# EAGLE design swdtousb (EAGLE 7.1.0)
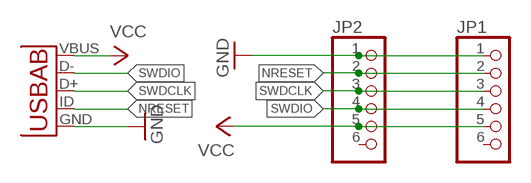
[diagram p0: schematic, sheet 1]

## Parts
JP1  PINHD-1X6  [1X06]
JP2  PINHD-1X6  [1X06]
U1  USB-AB  [USB-AB-MICRO]

## Nets
GND: JP1.1 JP2.1 U1.GND
NRESET: JP1.2 JP2.2 U1.ID(USBID)
SWDCLK: JP1.3 JP2.3 U1.D+
SWDIO: JP1.4 JP2.4 U1.D-
VCC: JP1.5 JP2.5 U1.VBUS
Unconnected: JP1.6 JP2.6

## Library data of the parts
JP1 JP2 = adafruit:PINHD-1X6: PIN HEADER
U1 = lightmeter:USB-AB: This is a USB AB connector that is compatible with USB OTG. i.e. this connector can serve as a host or device

## Board
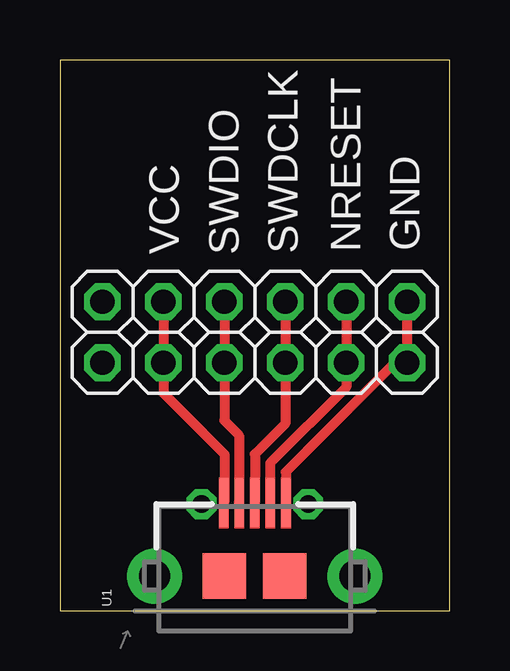
[diagram p1: board, top side]

Size 16.26 x 22.95 mm. Coordinates in mm from the lower left corner, seen from the top.
Outline: 0,0 16.26,0 16.26,22.95 0,22.95 0,0
Copper layers (1*16): Top 0.035mm / dielectric 1.5mm / Bottom 0.035mm
Design rules "default": minimum track width 10mil, minimum drill 24mil, track to track 8mil, track to pad 8mil, pad to pad 8mil, via to via 8mil, smd to smd 8mil, copper to edge 40mil, drill to drill 8mil, minimum pad ring 10mil, minimum via ring 8mil, stop-mask expansion 4mil, vias tented up to drill 0mil, thermal gap 10mil

### Footprints (pad centres in the part's own frame; a part is rotated, then mirrored left to right if it is on the bottom)
1X06 = drill 1.016 octagon: 1 -6.35,0; 2 -3.81,0; 3 -1.27,0; 4 1.27,0; 5 3.81,0; 6 6.35,0
USB-AB-MICRO = smd 2.1 x 0.4: D+ 3.05,0; D- 3.05,0.65; GND 3.05,-1.3; ID 3.05,-0.65; VBUS 3.05,1.3 | drill 1.3 pad 2.286: P$1 0,-4.175; P$2 0,4.175 | drill 0.737 pad 0.762 octagon: P$3 3,-2.225; P$4 3,2.225 | smd 1.9 x 1.8: P$6 0,1.275; P$7 0,-1.25

### Placement (x,y rotation side)
JP1  8.13,10.34 180 top
JP2  8.13,12.88 180 top
U1  8.13,1.45 90 top

### Tracks (layer width: path | path; a pad name or v marks a point on that pad's centre or on a via)
GND
  Top 0.406: U1.GND 9.42,5.79 13.97,10.34 JP1.1 JP2.1
NRESET
  Top 0.406: U1.ID 8.76,4.51 8.76,6.15 11.94,9.32 JP1.2 JP2.2
SWDCLK
  Top 0.406: U1.D+ 8.13,6.53 9.4,7.8 JP1.3 JP2.3
SWDIO
  Top 0.406: U1.D- 7.47,7.31 6.86,7.92 JP1.4 JP2.4
VCC
  Top 0.406: U1.VBUS 6.86,4.53 6.86,6.53 4.32,9.07 JP1.5 JP2.5

### Text on the board
tPlace: NRESET | GND | VCC | SWDIO | SWDCLK